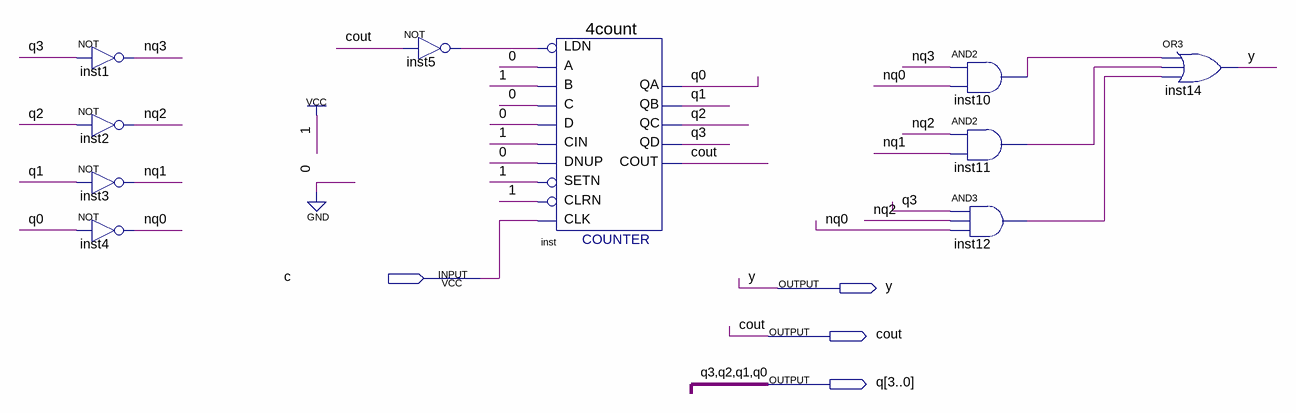
[diagram p0: schematic sheet]
// Quartus schematic s81_form.bdf as structural Verilog: 10 symbols, 4 pins
module s81_form (
  input  c,
  output y,
  output cout,
  output [3:0] q
);

  wire inst5_out, inst10_out, inst11_out, inst12_out, nq0, nq1, nq2, nq3;

  not inst1 (nq3, q[3]);
  not inst2 (nq2, q[2]);
  not inst3 (nq1, q[1]);
  not inst4 (nq0, q[0]);
  not inst5 (inst5_out, cout);
  \4count  inst (
    .LDN(inst5_out), .B(1'b1), .A(1'b0), .D(1'b0), .CIN(1'b1), .DNUP(1'b0), .CLK(c), .SETN(1'b1), .C(1'b0),
    .CLRN(1'b1), .QA(q[0]), .QB(q[1]), .QC(q[2]), .QD(q[3]), .COUT(cout));
  and inst10 (inst10_out, nq3, nq0);
  and inst11 (inst11_out, nq2, nq1);
  and inst12 (inst12_out, q[3], nq2, nq0);
  or inst14 (y, inst10_out, inst11_out, inst12_out);
endmodule
